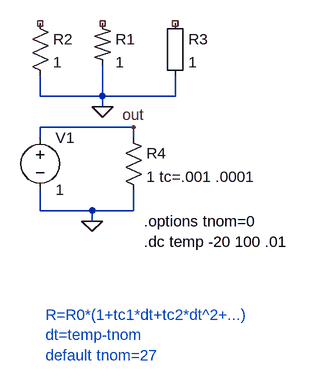
[diagram p0: schematic Draft1.asc]
Draft1.asc, the LTspice schematic file:
Version 4.1
SHEET 1 880 680
WIRE 144 160 144 128
WIRE 240 160 240 112
WIRE 240 160 144 160
WIRE 352 160 352 128
WIRE 352 160 240 160
WIRE 240 176 240 160
WIRE 288 208 144 208
WIRE 144 224 144 208
WIRE 288 224 288 208
WIRE 144 336 144 304
WIRE 224 336 144 336
WIRE 288 336 288 304
WIRE 288 336 224 336
WIRE 224 352 224 336
FLAG 240 176 0
FLAG 224 352 0
FLAG 288 208 out
SYMBOL res2 224 48 R0
SYMATTR InstName R1
SYMATTR Value 1
SYMBOL res 128 32 R0
SYMATTR InstName R2
SYMATTR Value 1
SYMBOL Misc\\EuropeanResistor 336 32 R0
SYMATTR InstName R3
SYMATTR Value 1
SYMBOL voltage 144 208 R0
WINDOW 123 0 0 Left 0
WINDOW 39 0 0 Left 0
SYMATTR InstName V1
SYMATTR Value 1
SYMBOL res 272 208 R0
SYMATTR InstName R4
SYMATTR Value 1 tc=.001 .0001
TEXT 304 352 Left 2 !.options tnom=0
TEXT 304 384 Left 2 !.dc temp -20 100 .01
TEXT 152 496 Left 2 ;R=R0*(1+tc1*dt+tc2*dt^2+...)\ndt=temp-tnom\ndefault tnom=27

The netlist it stands for:
* Draft1.asc
R1 NC_01 0 1
R2 NC_02 0 1
R3 NC_03 0 1
V1 out 0 1
R4 out 0 1 tc=.001 .0001
.options tnom=0
.dc temp -20 100 .01
* R=R0*(1+tc1*dt+tc2*dt^2+...)
* dt=temp-tnom
* default tnom=27
.backanno
.end